# Altium schematic sheet TopSheet.SchDoc: SIM868 Development Board
size 254 x 203 mm; SheetNumber: 1; SheetTotal: 14
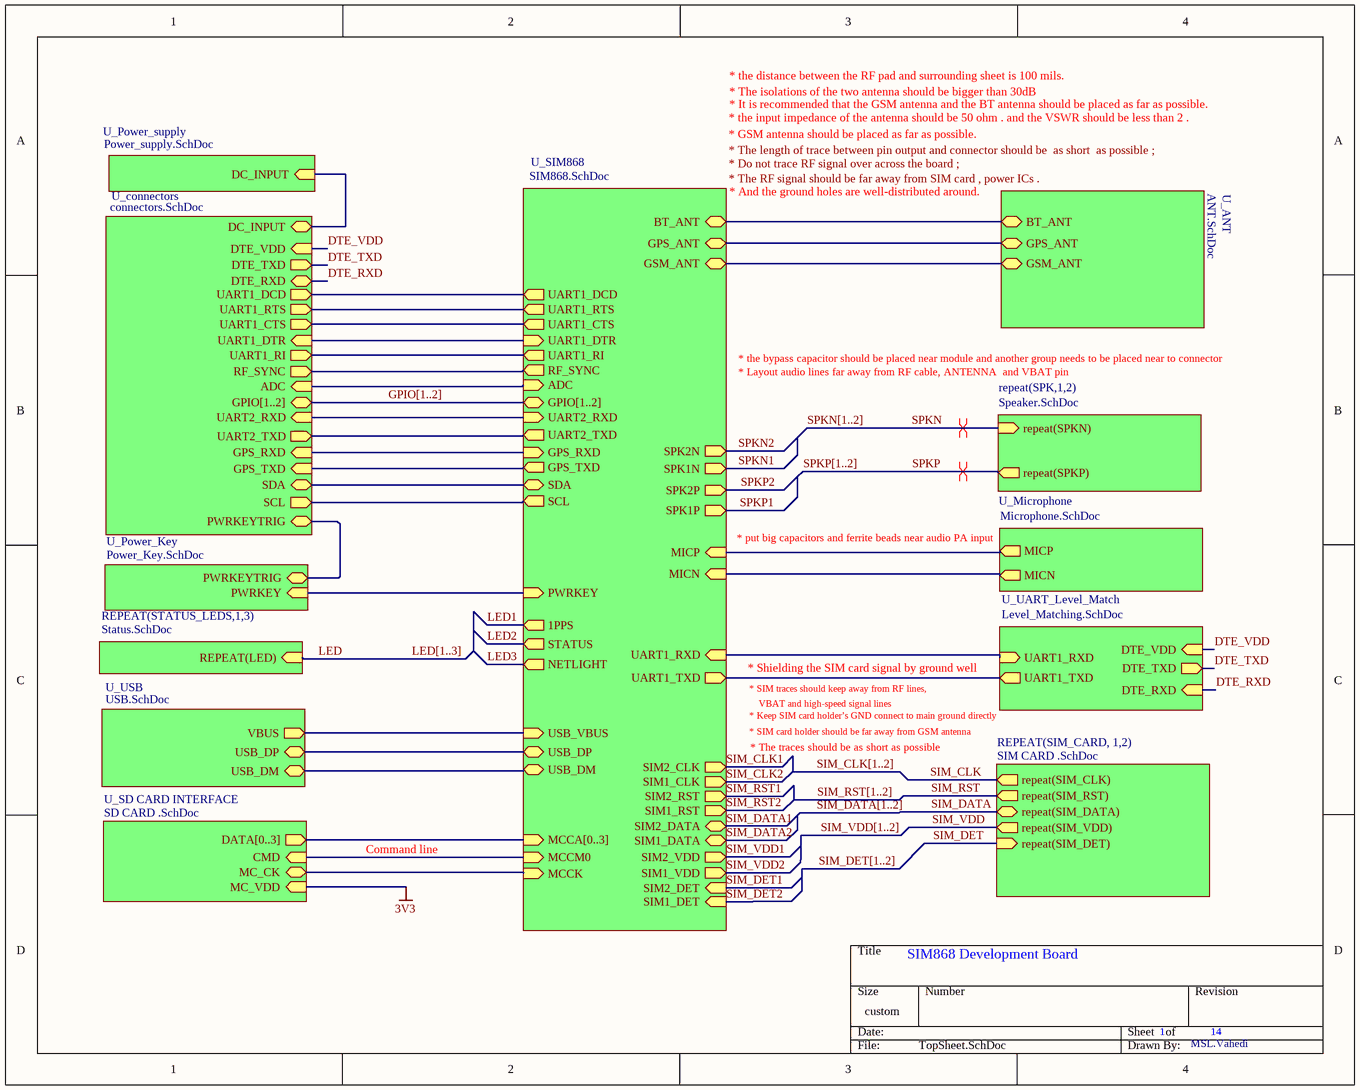
[diagram p0: TopSheet.SchDoc]

## Sub-sheets
REPEAT(SIM_CARD, 1,2) = SIM CARD .SchDoc: repeat(SIM_CLK) (out), repeat(SIM_RST) (out), repeat(SIM_DATA) (bidir), repeat(SIM_VDD) (out), repeat(SIM_DET) (in)
repeat(SPK,1,2) = Speaker.SchDoc: repeat(SPKP) (out), repeat(SPKN) (in)
REPEAT(STATUS_LEDS,1,3) = Status.SchDoc: REPEAT(LED) (in)
U_ANT = ANT.SchDoc: GSM_ANT (bidir), GPS_ANT (bidir), BT_ANT (bidir)
U_connectors = connectors.SchDoc: GPS_TXD (in), GPS_RXD (in), UART2_TXD (out), UART2_RXD (in), UART1_RTS (out), UART1_CTS (out), UART1_DCD (out), UART1_DTR (in), UART1_RI (out), GPIO[1..2] (bidir), PWRKEYTRIG (bidir), ADC (in), RF_SYNC (out), SDA (bidir), SCL (out), DTE_VDD (in), DTE_RXD (bidir), DTE_TXD (out), DC_INPUT (bidir)
U_Microphone = Microphone.SchDoc: MICP (out), MICN (out)
U_Power_Key = Power_Key.SchDoc: PWRKEY (in), PWRKEYTRIG (bidir)
U_Power_supply = Power_supply.SchDoc: DC_INPUT (in)
U_SD CARD INTERFACE = SD CARD .SchDoc: CMD (in), MC_CK (bidir), DATA[0..3] (out), MC_VDD (in)
U_SIM868 = SIM868.SchDoc: PWRKEY (in), SPK2N (out), SPK2P (out), SPK1N (out), SPK1P (out), MICN (in), MICP (in), MCCK (in), MCCM0 (in), 1PPS (out), MCCA[0..3] (in), NETLIGHT (out), STATUS (out), GPIO[1..2] (bidir), SIM2_DATA (bidir), SIM2_CLK (out), SIM2_RST (out), SIM2_VDD (out), GPS_TXD (out), GPS_RXD (in), UART1_TXD (out), UART1_RXD (in), UART2_TXD (out), UART2_RXD (in), USB_VBUS (in), USB_DP (bidir), USB_DM (bidir), ADC (in), SDA (bidir), SCL (out), SIM1_VDD (out), SIM1_DATA (bidir), SIM1_CLK (out), SIM1_RST (out), BT_ANT (bidir), GPS_ANT (bidir), GSM_ANT (bidir), RF_SYNC (out), UART1_RI (out), UART1_DTR (in), UART1_DCD (out), UART1_CTS (out), UART1_RTS (out), SIM1_DET (in), SIM2_DET (in)
U_UART_Level_Match = Level_Matching.SchDoc: DTE_VDD (in), DTE_RXD (in), UART1_TXD (out), DTE_TXD (out), UART1_RXD (in)
U_USB = USB.SchDoc: VBUS (out), USB_DM (bidir), USB_DP (bidir)

## Nets
3V3: sheet U_SD CARD INTERFACE/MC_VDD
DTE_RXD: sheet U_UART_Level_Match/DTE_RXD, sheet U_connectors/DTE_RXD
DTE_TXD: sheet U_UART_Level_Match/DTE_TXD, sheet U_connectors/DTE_TXD
DTE_VDD: sheet U_UART_Level_Match/DTE_VDD, sheet U_connectors/DTE_VDD
LED: sheet REPEAT(STATUS_LEDS,1,3)/REPEAT(LED)
LED1: sheet U_SIM868/1PPS
LED2: sheet U_SIM868/STATUS
LED3: sheet U_SIM868/NETLIGHT
SIM_CLK: sheet REPEAT(SIM_CARD, 1,2)/repeat(SIM_CLK)
SIM_CLK1: sheet U_SIM868/SIM2_CLK
SIM_CLK2: sheet U_SIM868/SIM1_CLK
SIM_DATA: sheet REPEAT(SIM_CARD, 1,2)/repeat(SIM_DATA)
SIM_DATA1: sheet U_SIM868/SIM2_DATA
SIM_DATA2: sheet U_SIM868/SIM1_DATA
SIM_DET: sheet REPEAT(SIM_CARD, 1,2)/repeat(SIM_DET)
SIM_DET1: sheet U_SIM868/SIM2_DET
SIM_DET2: sheet U_SIM868/SIM1_DET
SIM_RST: sheet REPEAT(SIM_CARD, 1,2)/repeat(SIM_RST)
SIM_RST1: sheet U_SIM868/SIM2_RST
SIM_RST2: sheet U_SIM868/SIM1_RST
SIM_VDD: sheet REPEAT(SIM_CARD, 1,2)/repeat(SIM_VDD)
SIM_VDD1: sheet U_SIM868/SIM2_VDD
SIM_VDD2: sheet U_SIM868/SIM1_VDD
SPKN: sheet repeat(SPK,1,2)/repeat(SPKN)
SPKN1: sheet U_SIM868/SPK1N
SPKN2: sheet U_SIM868/SPK2N
SPKP: sheet repeat(SPK,1,2)/repeat(SPKP)
SPKP1: sheet U_SIM868/SPK1P
SPKP2: sheet U_SIM868/SPK2P
(unnamed): sheet U_SIM868/PWRKEY, sheet U_Power_Key/PWRKEY
(unnamed): sheet U_SIM868/MICN, sheet U_Microphone/MICN
(unnamed): sheet U_SIM868/MICP, sheet U_Microphone/MICP
(unnamed): sheet U_SIM868/MCCK, sheet U_SD CARD INTERFACE/MC_CK
(unnamed): sheet U_SIM868/MCCM0, sheet U_SD CARD INTERFACE/CMD
(unnamed): sheet U_SIM868/GPS_TXD, sheet U_connectors/GPS_TXD
(unnamed): sheet U_SIM868/GPS_RXD, sheet U_connectors/GPS_RXD
(unnamed): sheet U_SIM868/UART1_TXD, sheet U_UART_Level_Match/UART1_TXD
(unnamed): sheet U_SIM868/UART1_RXD, sheet U_UART_Level_Match/UART1_RXD
(unnamed): sheet U_SIM868/UART2_TXD, sheet U_connectors/UART2_TXD
(unnamed): sheet U_SIM868/UART2_RXD, sheet U_connectors/UART2_RXD
(unnamed): sheet U_SIM868/USB_VBUS, sheet U_USB/VBUS
(unnamed): sheet U_SIM868/USB_DP, sheet U_USB/USB_DP
(unnamed): sheet U_SIM868/USB_DM, sheet U_USB/USB_DM
(unnamed): sheet U_SIM868/ADC, sheet U_connectors/ADC
(unnamed): sheet U_SIM868/SDA, sheet U_connectors/SDA
(unnamed): sheet U_SIM868/SCL, sheet U_connectors/SCL
(unnamed): sheet U_SIM868/BT_ANT, sheet U_ANT/BT_ANT
(unnamed): sheet U_SIM868/GPS_ANT, sheet U_ANT/GPS_ANT
(unnamed): sheet U_SIM868/GSM_ANT, sheet U_ANT/GSM_ANT
(unnamed): sheet U_SIM868/RF_SYNC, sheet U_connectors/RF_SYNC
(unnamed): sheet U_SIM868/UART1_RI, sheet U_connectors/UART1_RI
(unnamed): sheet U_SIM868/UART1_DTR, sheet U_connectors/UART1_DTR
(unnamed): sheet U_SIM868/UART1_DCD, sheet U_connectors/UART1_DCD
(unnamed): sheet U_SIM868/UART1_CTS, sheet U_connectors/UART1_CTS
(unnamed): sheet U_SIM868/UART1_RTS, sheet U_connectors/UART1_RTS
(unnamed): sheet U_Power_Key/PWRKEYTRIG, sheet U_connectors/PWRKEYTRIG
(unnamed): sheet U_connectors/DC_INPUT, sheet U_Power_supply/DC_INPUT

## Buses and harness runs
bus GPIO[1..2] = sheet U_connectors/GPIO[1..2] = sheet U_SIM868/GPIO[1..2]
bus LED[1..3]
bus sheet U_SD CARD INTERFACE/DATA[0..3] = sheet U_SIM868/MCCA[0..3]
bus SIM_CLK[1..2]
bus SIM_DATA[1..2]
bus SIM_DET[1..2]
bus SIM_RST[1..2]
bus SIM_VDD[1..2]
bus SPKN[1..2]
bus SPKP[1..2]

## Layout directives
differential pair: SPKN, SPKP

## Notes on the sheet
- * The isolations of the two antenna should be bigger than 30dB
- * the distance between the RF pad and surrounding sheet is 100 mils.
- * the input impedance of the antenna should be 50 ohm . and the VSWR should be less than 2 .
- * GSM antenna should be placed as far as possible.
- * The length of trace between pin output and connector should be  as short  as possible ;
- * Do not trace RF signal over across the board ;
- * It is recommended that the GSM antenna and the BT antenna should be placed as far as possible.
- * The RF signal should be far away from SIM card , power ICs .
- * And the ground holes are well-distributed around.
- * the bypass capacitor should be placed near module and another group needs to be placed near to connector
- * Layout audio lines far away from RF cable, ANTENNA  and VBAT pin
- * put big capacitors and ferrite beads near audio PA input
- * Shielding the SIM card signal by ground well
- * SIM traces should keep away from RF lines,
- VBAT and high-speed signal lines
- * SIM card holder should be far away from GSM antenna
- * Keep SIM card holder’s GND connect to main ground directly
- * The traces should be as short as possible
- Command line
- MSL.Vahedi
- Title
- Size:
- Date:
- A
- Number:
- Time:
- Revision:
- Sheet
- of
- File: